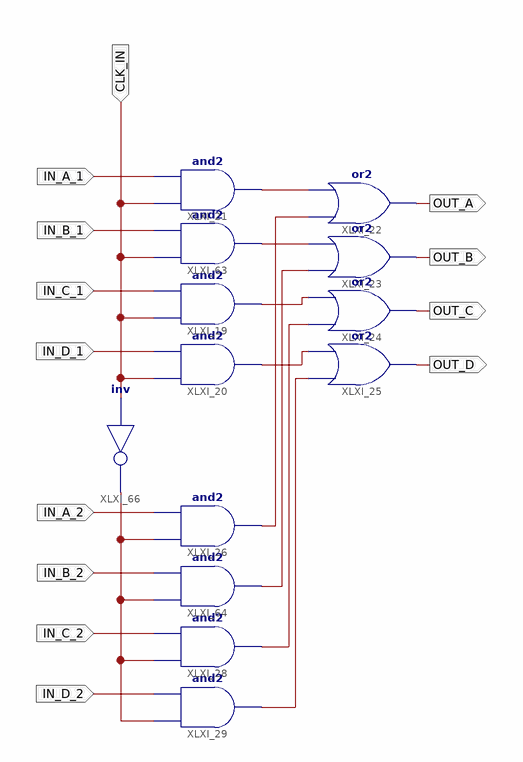
[diagram p0: schematic sheet 1]
// Xilinx ISE schematic Switch2Input.sch (spartan6) as structural Verilog: 13 symbols, 13 ports
module Switch2Input (
  input  IN_A_1,
  input  IN_B_1,
  input  IN_C_1,
  input  IN_D_1,
  input  CLK_IN,
  input  IN_D_2,
  input  IN_C_2,
  input  IN_B_2,
  input  IN_A_2,
  output OUT_A,
  output OUT_B,
  output OUT_C,
  output OUT_D
);

  wire XLXN_48, XLXN_50, XLXN_52, XLXN_188, XLXN_219, XLXN_220, XLXN_225, XLXN_226, XLXN_1147;

  and XLXI_20 (XLXN_225, CLK_IN, IN_D_1);
  and XLXI_19 (XLXN_226, CLK_IN, IN_C_1);
  and XLXI_63 (XLXN_220, CLK_IN, IN_B_1);
  and XLXI_21 (XLXN_219, CLK_IN, IN_A_1);
  or XLXI_22 (OUT_A, XLXN_48, XLXN_219);
  or XLXI_23 (OUT_B, XLXN_188, XLXN_220);
  or XLXI_24 (OUT_C, XLXN_50, XLXN_226);
  or XLXI_25 (OUT_D, XLXN_52, XLXN_225);
  not XLXI_66 (XLXN_1147, CLK_IN);
  and XLXI_29 (XLXN_52, XLXN_1147, IN_D_2);
  and XLXI_28 (XLXN_50, XLXN_1147, IN_C_2);
  and XLXI_64 (XLXN_188, XLXN_1147, IN_B_2);
  and XLXI_26 (XLXN_48, XLXN_1147, IN_A_2);
endmodule
